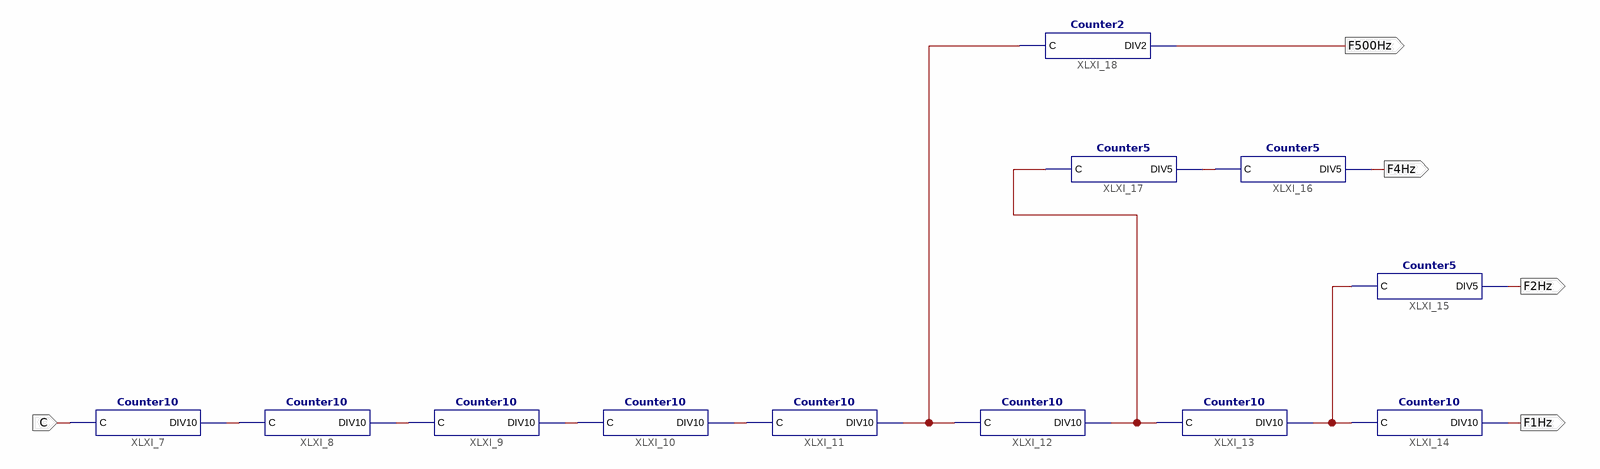
[diagram p0: schematic sheet 1]
// Xilinx ISE schematic ClockModule.sch (spartan6) as structural Verilog: 12 symbols, 5 ports
module ClockModule (
  input  C,
  output F1Hz,
  output F2Hz,
  output F4Hz,
  output F500Hz
);

  wire XLXN_5, XLXN_6, XLXN_7, XLXN_8, XLXN_11, XLXN_13, XLXN_17, XLXN_20;

  Counter10 XLXI_7 (.C(C), .DIV10(XLXN_5));
  Counter10 XLXI_8 (.C(XLXN_5), .DIV10(XLXN_6));
  Counter10 XLXI_9 (.C(XLXN_6), .DIV10(XLXN_7));
  Counter10 XLXI_10 (.C(XLXN_7), .DIV10(XLXN_8));
  Counter10 XLXI_11 (.C(XLXN_8), .DIV10(XLXN_20));
  Counter10 XLXI_12 (.C(XLXN_20), .DIV10(XLXN_17));
  Counter10 XLXI_13 (.C(XLXN_17), .DIV10(XLXN_11));
  Counter10 XLXI_14 (.C(XLXN_11), .DIV10(F1Hz));
  Counter5 XLXI_15 (.C(XLXN_11), .DIV5(F2Hz));
  Counter5 XLXI_16 (.C(XLXN_13), .DIV5(F4Hz));
  Counter5 XLXI_17 (.C(XLXN_17), .DIV5(XLXN_13));
  Counter2 XLXI_18 (.C(XLXN_20), .DIV2(F500Hz));
endmodule
